# Altium schematic sheet mach nguon 5V.SchDoc
size A; SheetNumber: 1; SheetTotal: 1
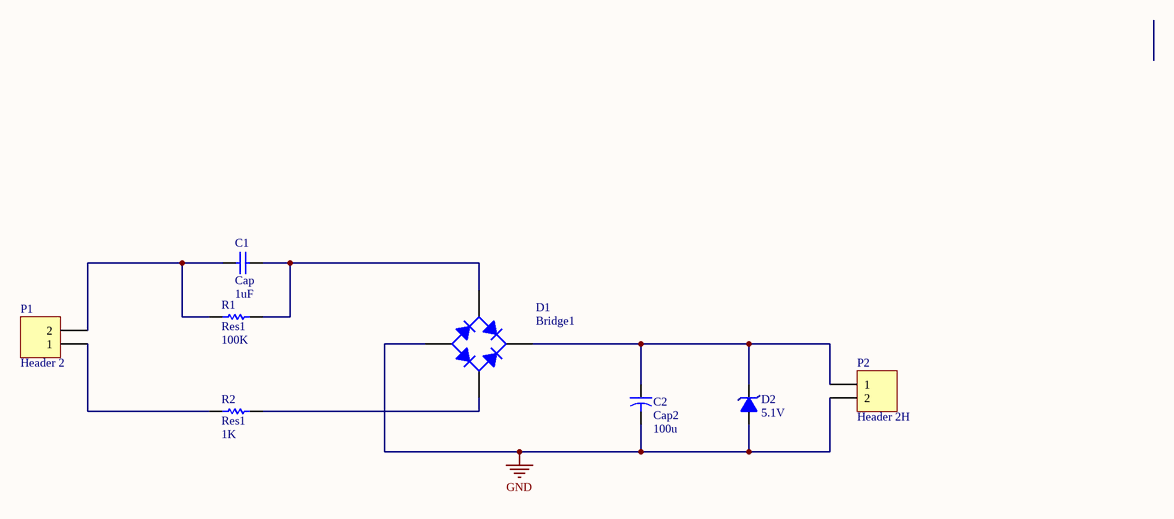
[diagram p0: mach nguon 5V.SchDoc]

## Parts
C1  Cap  value 1uF  [RAD-0.3]
C2  Cap2  value 100u  [CAPR5-4X5]
D1  Bridge1  [D-38]
D2  5.1V  [DIODE ZENNER SMD SOD80]
P1  Header 2  [HDR1X2]
P2  Header 2H  [HDR1X2H]
R1  Res1  value 100K  [AXIAL-0.3]
R2  Res1  value 1K  [AXIAL-0.3]

## Nets
GND: C2.2 D1.3(A) D2.1(A) P2.2
NetC1_1: C1.1 P1.2 R1.1
NetC1_2: C1.2 D1.4(C) R1.2
NetC2_1: C2.1 D1.1(K) D2.2(K) P2.1
NetD1_2: D1.2(C) R2.2
NetP1_1: P1.1 R2.1

## Library data of the parts
C1 = Cap: Capacitor; Published: 8-Jun-2000; LatestRevisionDate: 17-Jul-2002; LatestRevisionNote: Re-released for DXP Platform.; PackageReference: RAD-0.3; Publisher: Altium Limited; PackageDescription: Radial Cap, Thru-Hole; 2 Leads; 0.3 in Pin Spacing
C2 = Cap2: Capacitor; Published: 23-Sep-2002; PackageReference: CAPR5-4X5; Publisher: Altium Limited; PackageDescription: Capacitor; 2 Leads
D1 = Bridge1: Full Wave Diode Bridge; Published: 8-Jun-2000; LatestRevisionDate: 29-May-2009; LatestRevisionNote: Sch pins A & K swapped.; DatasheetVersion: E2732B; PackageReference: D-38; Publisher: Altium Limited; PackageDescription: Bridge Rectifier; 4 Terminals; Body 9.4 x 9.4 mm (typ); Pitch 5.08 mm
D2 = Diode Zener 5.1V: Dán; Ma_Hang: MH002881; Ten_Linh_Kien: Diode Zener 1/2W 5.1V SMD1206 ZMM5.1; Don_Vi: Con; Kieu_Chan: *; Ghi_Chu: *; Chung_Loai: Dán
P1 = Header 2: Header, 2-Pin; LatestRevisionDate: 17-Jul-2002; LatestRevisionNote: Re-released for DXP Platform.; Publisher: Altium Limited
P2 = Header 2H: Header, 2-Pin, Right Angle; LatestRevisionDate: 17-Jul-2002; LatestRevisionNote: Re-released for DXP Platform.; Publisher: Altium Limited
R1 R2 = Res1: Resistor; Published: 8-Jun-2000; LatestRevisionDate: 17-Jul-2002; LatestRevisionNote: Re-released for DXP Platform.; PackageReference: AXIAL-0.3; Publisher: Altium Limited; PackageDescription: Axial Device, Thru-Hole; 2 Leads; 0.3 in Pin Spacing